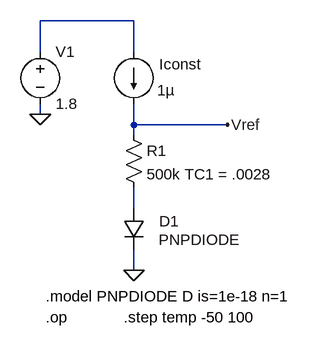
[diagram p0: schematic ID_V2.asc]
ID_V2.asc, the LTspice schematic file:
Version 4
SHEET 1 2876 680
WIRE 1680 -768 1536 -768
WIRE 1536 -720 1536 -768
WIRE 1680 -720 1680 -768
WIRE 1536 -624 1536 -640
WIRE 1680 -608 1680 -640
WIRE 1824 -608 1680 -608
WIRE 1680 -592 1680 -608
WIRE 1680 -480 1680 -512
WIRE 1680 -384 1680 -416
FLAG 1680 -384 0
FLAG 1824 -608 Vref
FLAG 1536 -624 0
SYMBOL diode 1664 -480 R0
WINDOW 0 55 20 Left 2
WINDOW 3 54 49 Left 2
SYMATTR InstName D1
SYMATTR Value PNPDIODE
SYMBOL current 1680 -720 R0
WINDOW 0 39 19 Left 2
WINDOW 3 36 59 Left 2
SYMATTR InstName Iconst
SYMATTR Value 1µ
SYMBOL res 1664 -608 R0
SYMATTR InstName R1
SYMATTR Value 500k TC1 = .0028
SYMBOL voltage 1536 -736 R0
WINDOW 123 0 0 Left 2
WINDOW 39 0 0 Left 2
SYMATTR InstName V1
SYMATTR Value 1.8
TEXT 1544 -344 Left 2 !.model PNPDIODE D is=1e-18 n=1
TEXT 1544 -312 Left 2 !.op
TEXT 1664 -312 Left 2 !.step temp -50 100

The netlist it stands for:
* ID_V2.asc
D1 N002 0 PNPDIODE
Iconst N001 Vref 1µ
R1 Vref N002 500k TC1 = .0028
V1 N001 0 1.8
.model D D
.lib standard.dio
.model PNPDIODE D is=1e-18 n=1
.op
.step temp -50 100
.backanno
.end